# Altium schematic sheet [02]-BLOCK_DIAGRAM.SchDoc
size A4
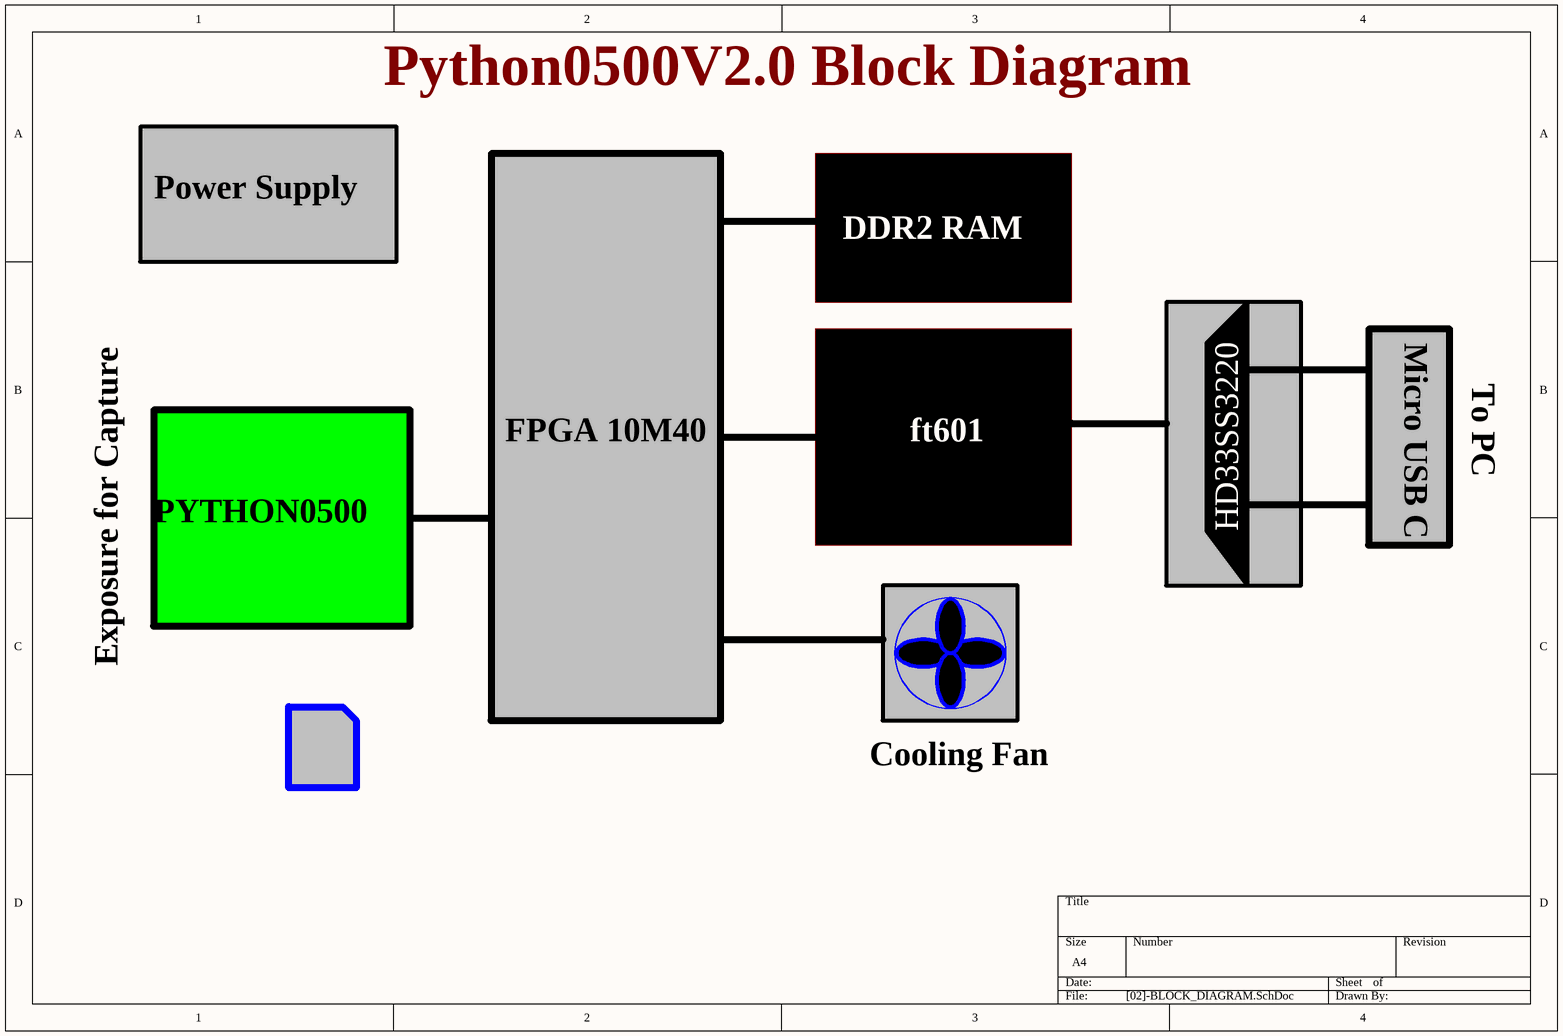
[diagram p0: [02]-BLOCK_DIAGRAM.SchDoc]

## Notes on the sheet
- Python0500V2.0 Block Diagram
- Power Supply
- DDR2 RAM
- Micro USB C
- To PC
- FPGA 10M40
- ft601
- PYTHON0500
- HD33SS3220
- Exposure for Capture
- Cooling Fan